# Altium schematic sheet mux_usb.SchDoc
size A
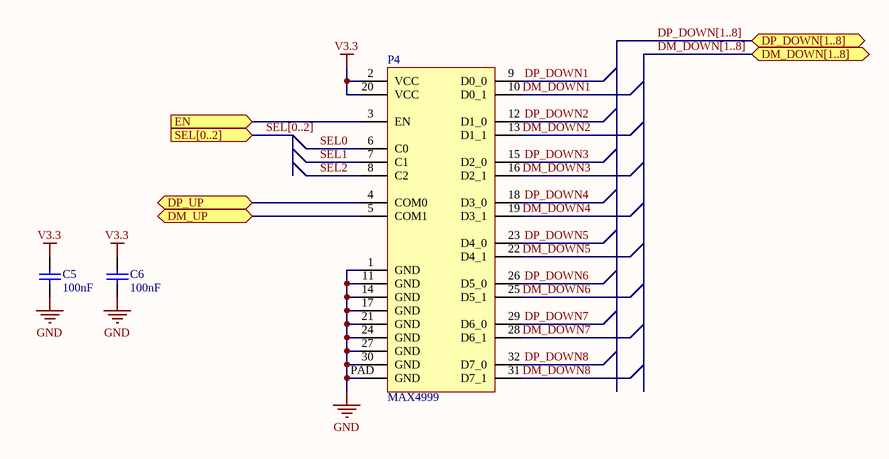
[diagram p0: mux_usb.SchDoc]

## Parts
C5  100nF  [0402]
C6  100nF  [0402]
P4  MAX4999  [MAXIM_T3255+4]

## Ports
DM_DOWN[1..8] (bidir), DM_UP (bidir), DP_DOWN[1..8] (bidir), DP_UP (bidir), EN (in), SEL[0..2] (in)

## Nets
GND: C5.1 C6.1 P4.1(GND) P4.11(GND) P4.14(GND) P4.17(GND) P4.21(GND) P4.24(GND) P4.27(GND) P4.30(GND) P4.PAD(GND)
V3.3: C5.2 C6.2 P4.2(VCC) P4.20(VCC)
DM_DOWN1: P4.10(D0_1)
DM_DOWN2: P4.13(D1_1)
DM_DOWN3: P4.16(D2_1)
DM_DOWN4: P4.19(D3_1)
DM_DOWN5: P4.22(D4_1)
DM_DOWN6: P4.25(D5_1)
DM_DOWN7: P4.28(D6_1)
DM_DOWN8: P4.31(D7_1)
DM_UP: P4.5(COM1) ; port DM_UP
DP_DOWN1: P4.9(D0_0)
DP_DOWN2: P4.12(D1_0)
DP_DOWN3: P4.15(D2_0)
DP_DOWN4: P4.18(D3_0)
DP_DOWN5: P4.23(D4_0)
DP_DOWN6: P4.26(D5_0)
DP_DOWN7: P4.29(D6_0)
DP_DOWN8: P4.32(D7_0)
DP_UP: P4.4(COM0) ; port DP_UP
EN: P4.3(EN) ; port EN
SEL0: P4.6(C0)
SEL1: P4.7(C1)
SEL2: P4.8(C2)

## Buses and harness runs
bus DM_DOWN[1..8] = port DM_DOWN[1..8]
bus DP_DOWN[1..8] = port DP_DOWN[1..8]
bus SEL[0..2] = port SEL[0..2]

## Library data of the parts
C5 C6 = Capacitor: Value: 100nF